# EAGLE design MovuinoHealthBandV0.2.4-EC (EAGLE 9.5.2)
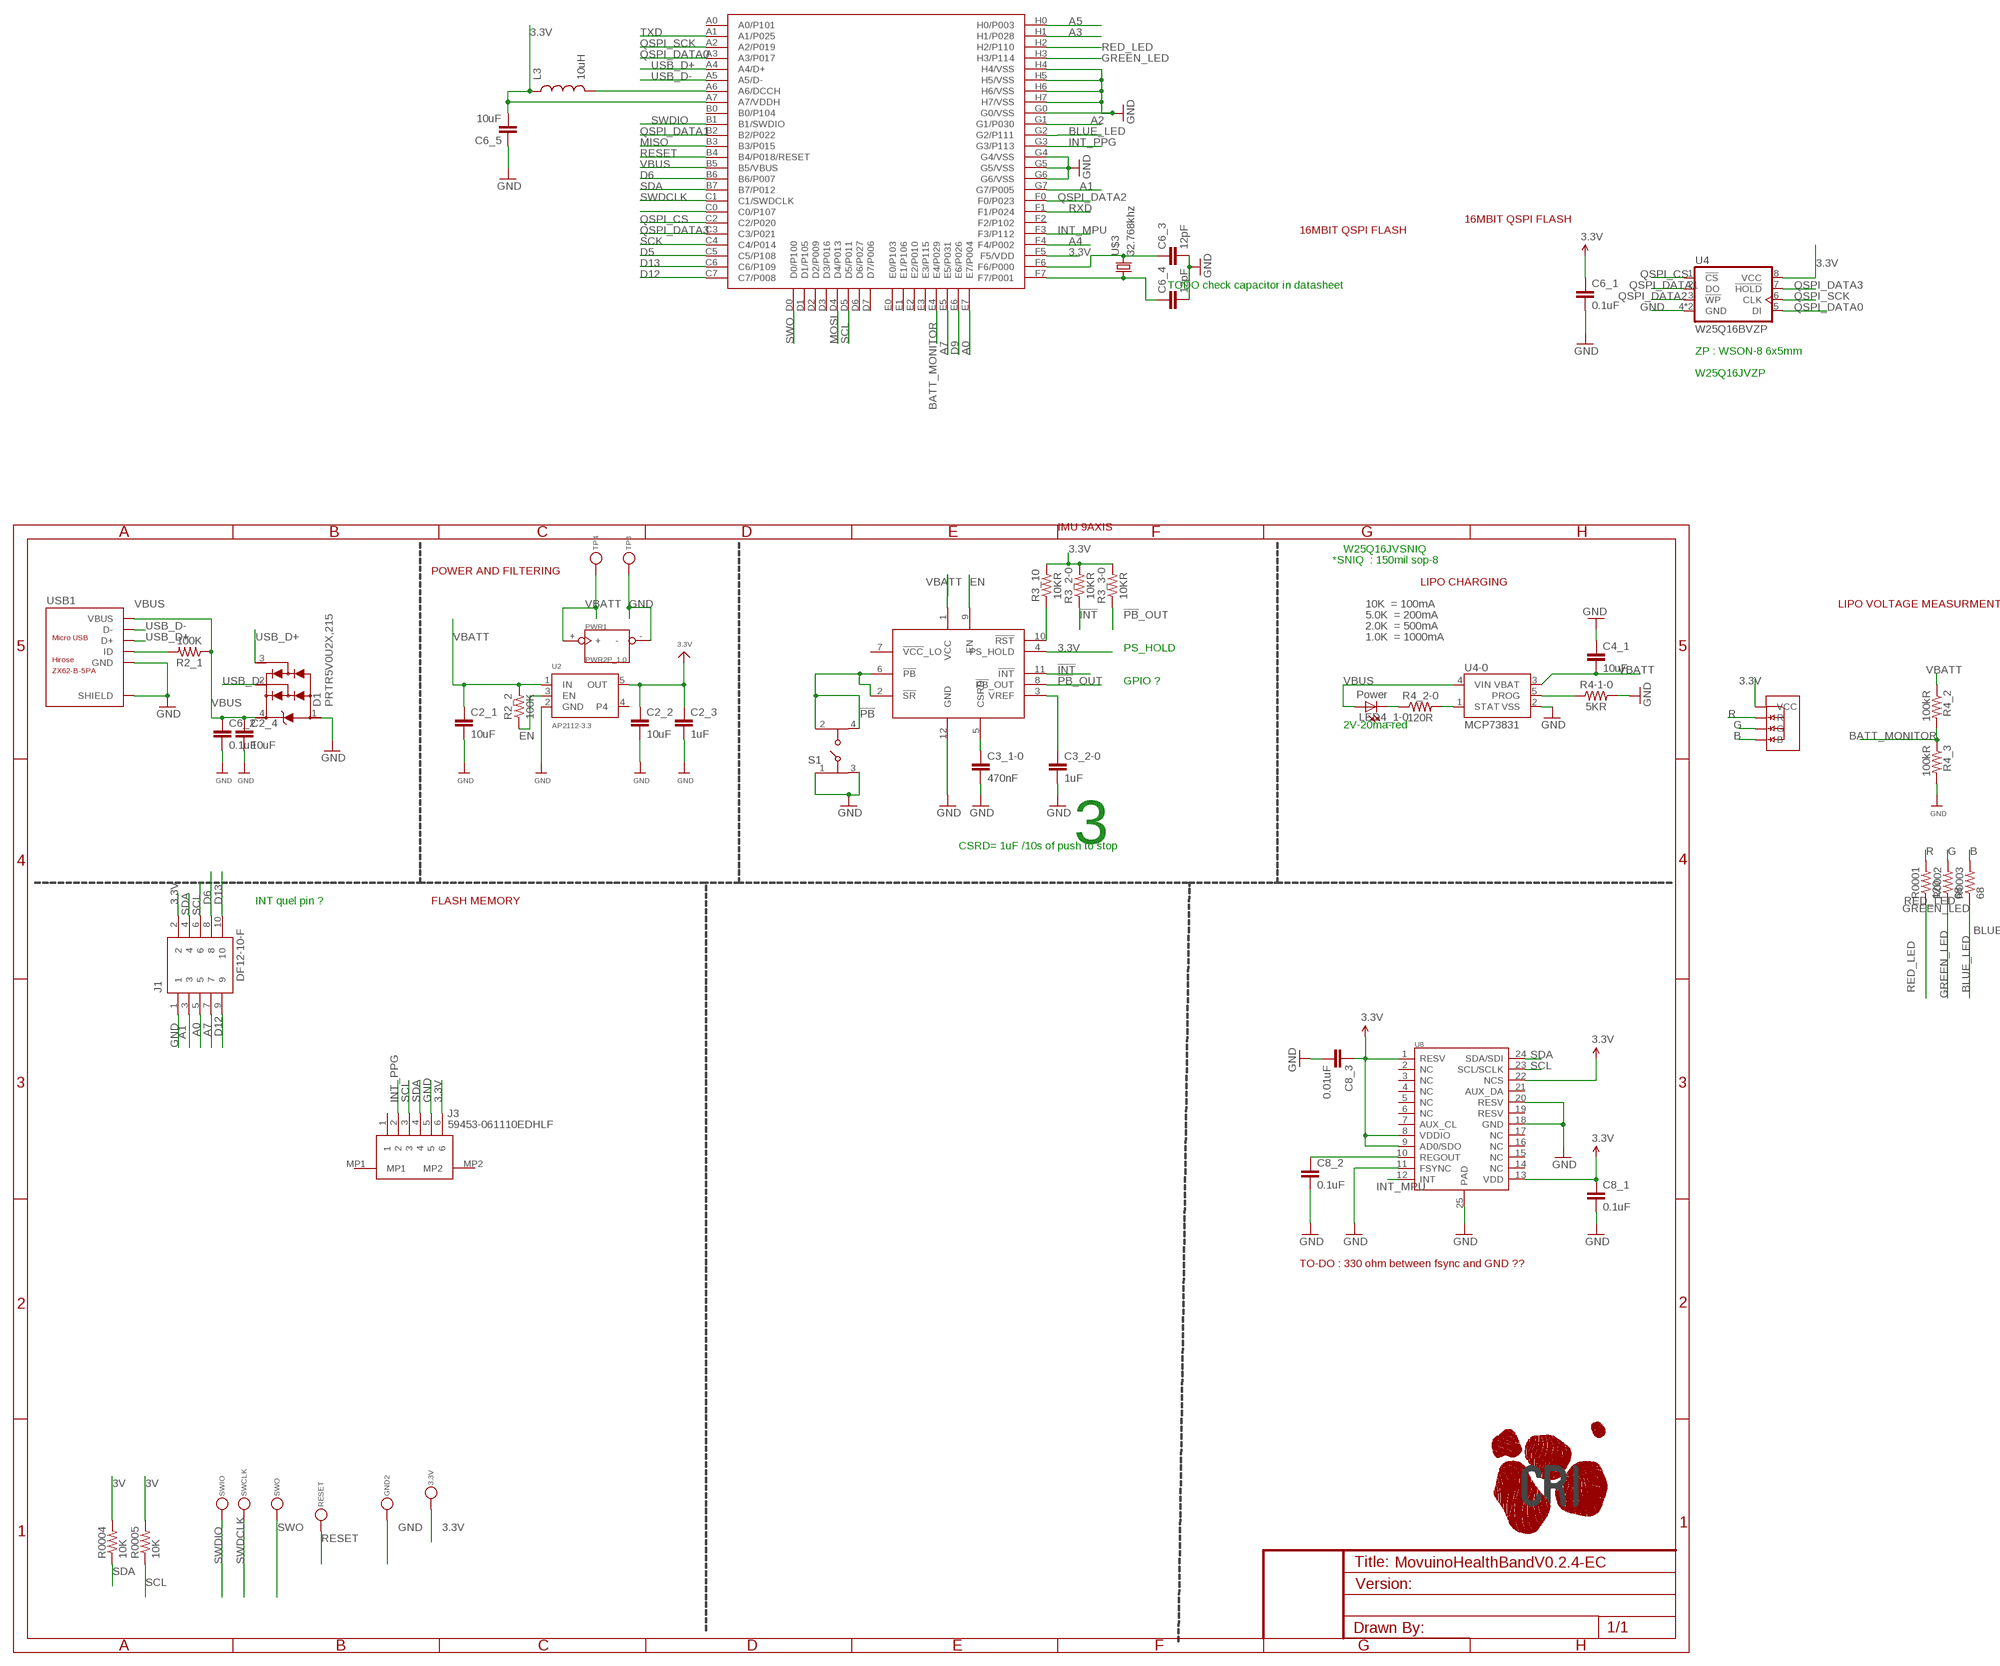
[diagram p0: schematic, sheet 1, part 1 of 2]
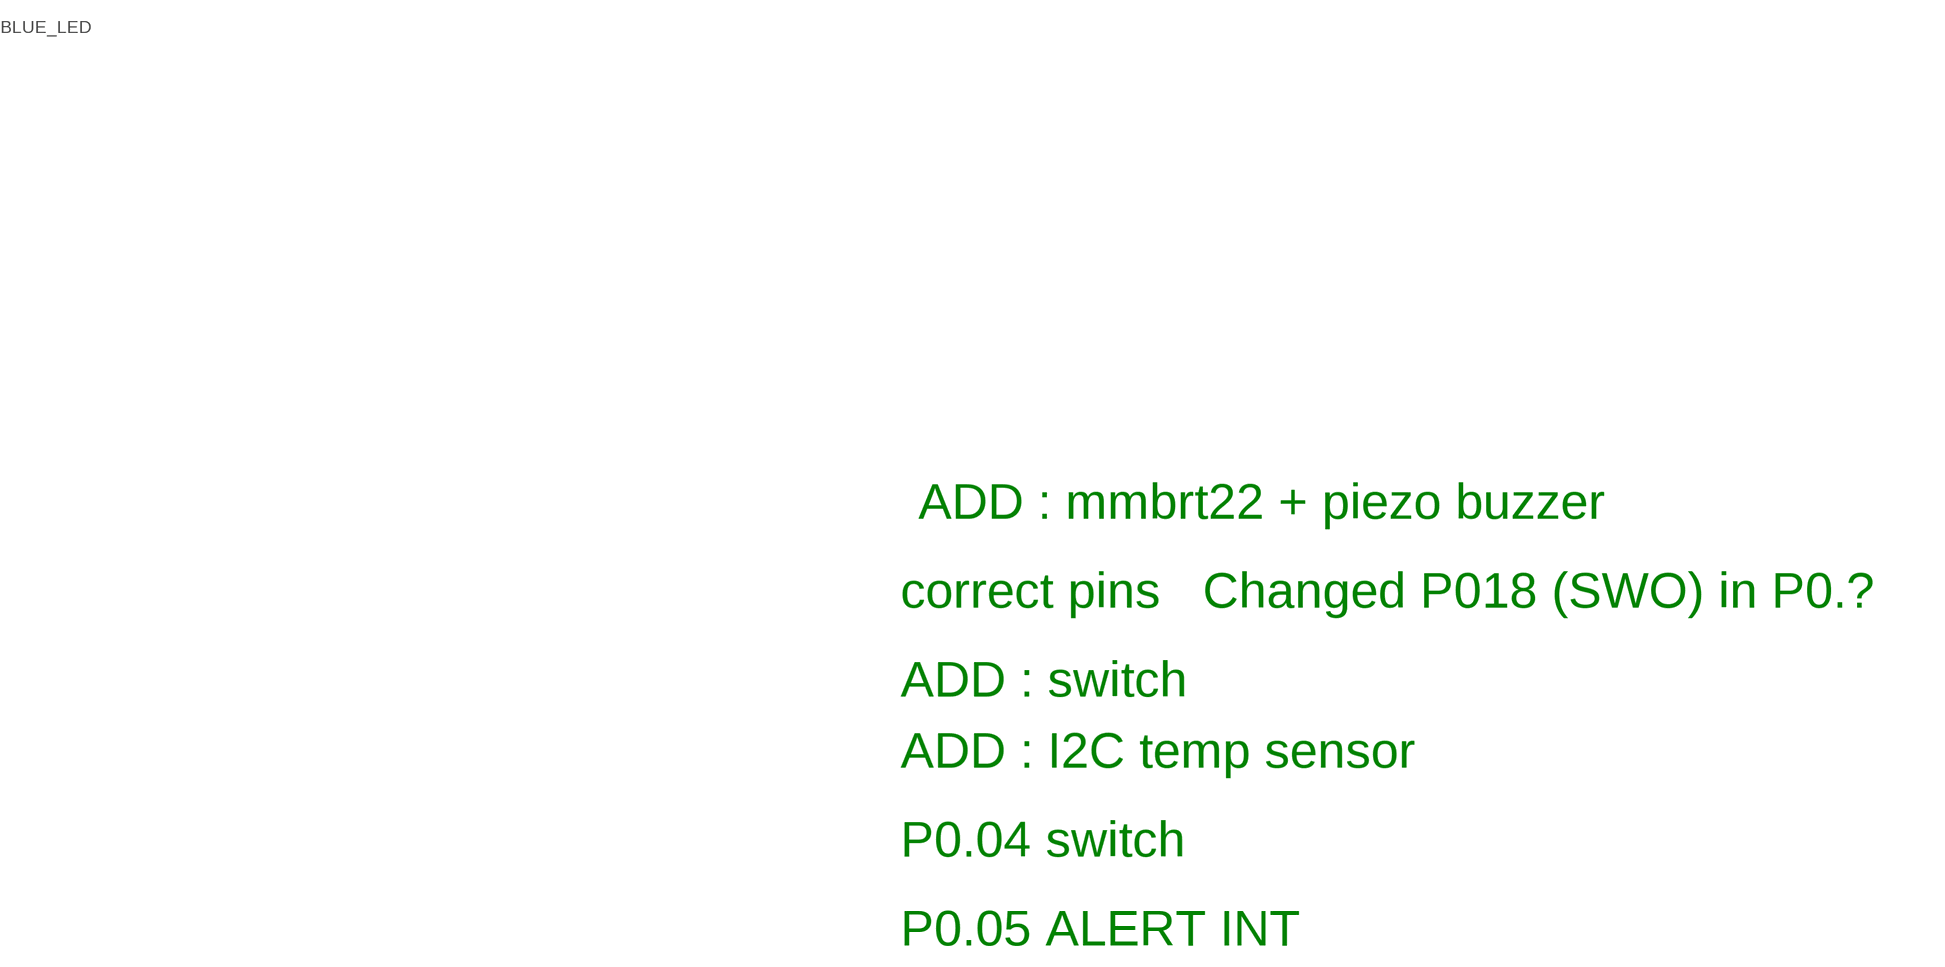
[diagram p1: schematic, sheet 1, part 2 of 2]

## Parts
3.3V  TESTPOINTROUND1MM  [TESTPOINT_ROUND_1MM]
C2_1  10uF  CAP0402-CAP-SMALL-TDOCU  [0402-CAP-SMALL-TDOCU]
C2_2  10uF  CAP0402-CAP-SMALL-TDOCU  [0402-CAP-SMALL-TDOCU]
C2_3  1uF  CAP0402-CAP-SMALL-TDOCU  [0402-CAP-SMALL-TDOCU]
C2_4  10uF  CAP0402-CAP-SMALL-TDOCU  [0402-CAP-SMALL-TDOCU]
C3_1-0  470nF  CAP0402-1UF  [0402-CAP]
C3_2-0  1uF  CAP0402-1UF  [0402-CAP]
C4_1  10uF  CAP0402-CAP-SMALL-TDOCU  [0402-CAP-SMALL-TDOCU]
C6_1  0.1uF  CAP0402-CAP-SMALL-TDOCU  [0402-CAP-SMALL-TDOCU]
C6_2  0.1uF  CAP0402-CAP-SMALL-TDOCU  [0402-CAP-SMALL-TDOCU]
C6_3  12pF  CAP0402-CAP-SMALL-TDOCU  [0402-CAP-SMALL-TDOCU]
C6_4  12pF  CAP0402-CAP-SMALL-TDOCU  [0402-CAP-SMALL-TDOCU]
C6_5  10uF  CAP0402-CAP-SMALL-TDOCU  [0402-CAP-SMALL-TDOCU]
C8_1  0.1uF  CAP0402-CAP-SMALL-TDOCU  [0402-CAP-SMALL-TDOCU]
C8_2  0.1uF  CAP0402-CAP-SMALL-TDOCU  [0402-CAP-SMALL-TDOCU]
C8_3  0.01uF  CAP0402-CAP-SMALL-TDOCU  [0402-CAP-SMALL-TDOCU]
D1  PRTR5V0U2X,215  [SOT143B]
GND2  TESTPOINTROUND1MM  [TESTPOINT_ROUND_1MM]
J1  DF12-10-F  [DF12-10-DP]
J3  59453-061110EDHLF  [59453061110EDHLF]
L3  10uH  INDUCTOR0402  [C0402]
LED4_1-0  Power  LED0603-RED-STD  [LED-0603]
PWR1  PWR2P_1.0  [PWR2P_1.0]
R0001  120  RESISTOR0402-10K  [0402-RES]
R0002  68  RESISTOR0402-10K  [0402-RES]
R2_1  100K  RESISTORR0402-SMALL-TDOCU  [R0402-SMALL-TDOCU]
R2_2  100K  RESISTORR0402-SMALL-TDOCU  [R0402-SMALL-TDOCU]
R0003  68  RESISTOR0402-10K  [0402-RES]
R3_2-0  10KR  RESISTORR0402-SMALL-TDOCU  [R0402-SMALL-TDOCU]
R3_3-0  10KR  RESISTORR0402-SMALL-TDOCU  [R0402-SMALL-TDOCU]
R3_10  10KR  RESISTORR0402-SMALL-TDOCU  [R0402-SMALL-TDOCU]
R0004  10K  RESISTOR0402-10K  [0402-RES]
R4-1-0  5KR  RESISTORR0402-SMALL-TDOCU  [R0402-SMALL-TDOCU]
R4_2  100kR  RESISTOR0402-10K  [0402-RES]
R4_2-0  120R  RESISTORR0402-SMALL-TDOCU  [R0402-SMALL-TDOCU]
R4_3  100kR  RESISTOR0402-10K  [0402-RES]
R0005  10K  RESISTOR0402-10K  [0402-RES]
RESET  TESTPOINTROUND1MM  [TESTPOINT_ROUND_1MM]
S1  434331045822  [434331045822]
SWCLK  TESTPOINTROUND1MM  [TESTPOINT_ROUND_1MM]
SWIO  TESTPOINTROUND1MM  [TESTPOINT_ROUND_1MM]
SWO  TESTPOINTROUND1MM  [TESTPOINT_ROUND_1MM]
TP3  TESTPOINT1X1.5MM_NOCREAM_NOSILK  [PAD-1X1.5_NOSILK]
TP4  TESTPOINT1X1.5MM_NOCREAM_NOSILK  [PAD-1X1.5_NOSILK]
U2  AP2112-3.3  VREG_SOT23-5  [SOT23-5]
U3  BC840  [BC840]
U3-0  STM6601  [TDFN12]
U4  W25Q16BVZP  [WSON8]
U4-0  MCP73831  [SOT23-5]
U8  MPU-9250  [LEAD-QFN24]
U$2  LOGO-CRI-NEW-110MM-BOTTOM-SILK  [LOGO_CRI-NEW-BMP10MM-BOTTOM]
U$3  32.768khz  CRYSTAL-NOGND  [CRYSTAL-SMD-2X1.2-ABS06]
U$24  LRTB_R48G  [LRTB_R48G]
USB1  MICRO-USB-SMD(ZX62-B-5PA)TB1  [MICRO-USB5+6P-SMD-0.65-AB-TB]

## Nets
3.3V [EC-Class7-drill0.15]: 3.3V.P$1 C2_2.1 C2_3.1 C6_1.1 C6_5.2 C8_1.1 C8_3.1 J1.2 J3.6 L3.1 R3_2-0.2 R3_3-0.2 R3_10.2 U2.5(OUT) U3-0.4(PS_HOLD) U3.A7(A7/VDDH) U3.F5(F5/VDD) U4.8(VCC) U8.1(RESV) U8.8(VDDIO) U8.9(AD0/SDO) U8.13(VDD) U8.22(NCS) U$24.1(VCC)
3V [EC-Class7-drill0.15]: R0004.2 R0005.2
!INT! [EC-Class7-drill0.15]: R3_2-0.1 U3-0.11(!INT!)
!PB! [EC-Class7-drill0.15]: S1.2 S1.4 U3-0.2(!SR!) U3-0.6(!PB!)
!PB!_OUT [EC-Class7-drill0.15]: R3_3-0.1 U3-0.8(!PB!_OUT)
A0 [EC-Class7-drill0.15]: J1.5 U3.E7(E7/P004)
A1 [EC-Class7-drill0.15]: J1.3 U3.G7(G7/P005)
A2 [EC-Class7-drill0.15]: U3.G1(G1/P030)
A3 [EC-Class7-drill0.15]: U3.H1(H1/P028)
A4 [EC-Class7-drill0.15]: U3.F4(F4/P002)
A5 [EC-Class7-drill0.15]: U3.H0(H0/P003)
A7 [EC-Class7-drill0.15]: J1.7 U3.E5(E5/P031)
B [EC-Class7-drill0.15]: R0003.2 U$24.4(B)
BATT_MONITOR [EC-Class7-drill0.15]: R4_2.2 R4_3.1 U3.E4(E4/P029)
BLUE_LED [EC-Class7-drill0.15]: R0003.1 U3.G2(G2/P111)
CSRD [EC-Class7-drill0.15]: C3_1-0.1 U3-0.5(CSRD)
D5 [EC-Class7-drill0.15]: U3.C5(C5/P108)
D6 [EC-Class7-drill0.15]: J1.8 U3.B6(B6/P007)
D9 [EC-Class7-drill0.15]: U3.E6(E6/P026)
D12 [EC-Class7-drill0.15]: J1.9 U3.C7(C7/P008)
D13 [EC-Class7-drill0.15]: J1.10 U3.C6(C6/P109)
EN [EC-Class7-drill0.15]: R2_2.1 U2.3(EN) U3-0.9(EN)
G [EC-Class7-drill0.15]: R0002.2 U$24.3(G)
GND [EC-Class7-drill0.15]: C2_1.2 C2_2.2 C2_3.2 C2_4.2 C3_1-0.2 C3_2-0.2 C4_1.1 C6_1.2 C6_2.2 C6_3.2 C6_4.2 C6_5.1 C8_1.2 C8_2.2 C8_3.2 D1.1 GND2.P$1 J1.1 J3.5 PWR1.- R4-1-0.2 R4_3.2 S1.1 S1.3 TP3.P$1 U2.2(GND) U3-0.12(GND) U3.G0(G0/VSS) U3.G4(G4/VSS) U3.G5(G5/VSS) U3.G6(G6/VSS) U3.H4(H4/VSS) U3.H5(H5/VSS) U3.H6(H6/VSS) U3.H7(H7/VSS) U4-0.2(VSS) U4.4(GND) U4.9(GND) U8.11(FSYNC) U8.18(GND) U8.20(RESV) U8.25(PAD) USB1.5(GND) USB1.P1(SHIELD) USB1.P2(SHIELD) USB1.P5(SHIELD) USB1.P6(SHIELD) USB1.P$3(SHIELD) USB1.P$4(SHIELD)
GREEN_LED [EC-Class7-drill0.15]: R0002.1 U3.H3(H3/P114)
INT_MPU [EC-Class7-drill0.15]: U3.F3(F3/P112) U8.12(INT)
INT_PPG [EC-Class7-drill0.15]: J3.2 U3.G3(G3/P113)
MISO [EC-Class7-drill0.15]: U3.B3(B3/P015)
MOSI [EC-Class7-drill0.15]: U3.D4(D4/P013)
N$2 [EC-Class7-drill0.15]: R4_2-0.2 U4-0.1(STAT)
N$3 [EC-Class7-drill0.15]: R2_1.2 USB1.4(ID)
N$4 [EC-Class7-drill0.15]: C6_3.1 U3.F6(F6/P000) U$3.P$2
N$6 [EC-Class7-drill0.15]: C6_4.1 U3.F7(F7/P001) U$3.P$1
N$7 [EC-Class7-drill0.15]: R3_10.1 U3-0.10(!RST!)
N$8 [EC-Class7-drill0.15]: LED4_1-0.C R4_2-0.1
N$10 [EC-Class7-drill0.15]: R4-1-0.1 U4-0.5(PROG)
N$17 [EC-Class7-drill0.15]: L3.2 U3.A6(A6/DCCH)
N$23 [EC-Class7-drill0.15]: U3.C0(C0/P107)
N$28 [EC-Class7-drill0.15]: C8_2.1 U8.10(REGOUT)
QSPI_CS [EC-Class7-drill0.15]: U3.C2(C2/P020) U4.1(!CS!)
QSPI_DATA0 [EC-Class7-drill0.15]: U3.A3(A3/P017) U4.5(DI)
QSPI_DATA1 [EC-Class7-drill0.15]: U3.B2(B2/P022) U4.2(DO)
QSPI_DATA2 [EC-Class7-drill0.15]: U3.F0(F0/P023) U4.3(!WP!)
QSPI_DATA3 [EC-Class7-drill0.15]: U3.C3(C3/P021) U4.7(!HOLD!)
QSPI_SCK [EC-Class7-drill0.15]: U3.A2(A2/P019) U4.6(CLK)
R [EC-Class7-drill0.15]: R0001.2 U$24.2(R)
RED_LED [EC-Class7-drill0.15]: R0001.1 U3.H2(H2/P110)
RESET [EC-Class7-drill0.15]: RESET.P$1 U3.B4(B4/P018/RESET)
RXD [EC-Class7-drill0.15]: U3.F1(F1/P024)
SCK [EC-Class7-drill0.15]: U3.C4(C4/P014)
SCL [EC-Class7-drill0.15]: J1.6 J3.3 R0005.1 U3.D5(D5/P011) U8.23(SCL/SCLK)
SDA [EC-Class7-drill0.15]: J1.4 J3.4 R0004.1 U3.B7(B7/P012) U8.24(SDA/SDI)
SWDCLK [EC-Class7-drill0.15]: SWCLK.P$1 U3.C1(C1/SWDCLK)
SWDIO [EC-Class7-drill0.15]: SWIO.P$1 U3.B1(B1/SWDIO)
SWO [EC-Class7-drill0.15]: SWO.P$1 U3.D0(D0/P100)
TXD [EC-Class7-drill0.15]: U3.A1(A1/P025)
USB_D+ [EC-Class7-drill0.15]: D1.3 U3.A4(A4/D+) USB1.3(D+)
USB_D- [EC-Class7-drill0.15]: D1.2 U3.A5(A5/D-) USB1.2(D-)
VBATT [EC-Class7-drill0.15]: C2_1.1 C4_1.2 PWR1.+ R2_2.2 R4_2.1 TP4.P$1 U2.1(IN) U3-0.1(VCC) U4-0.3(VBAT)
VBUS [EC-Class7-drill0.15]: C2_4.1 C6_2.1 D1.4 LED4_1-0.A R2_1.1 U3.B5(B5/VBUS) U4-0.4(VIN) USB1.1(VBUS)
VREF [EC-Class7-drill0.15]: C3_2-0.1 U3-0.3(VREF)
Unconnected: J3.1 J3.MP1 J3.MP2 U2.4 U3-0.7(!VCC!_LO) U3.A0(A0/P101) U3.B0(B0/P104) U3.D1(D1/P105) U3.D2(D2/P009) U3.D3(D3/P016) U3.D6(D6/P027) U3.D7(D7/P006) U3.E0(E0/P103) U3.E1(E1/P106) U3.E2(E2/P010) U3.E3(E3/P115) U3.F2(F2/P102) U8.2(NC) U8.3(NC) U8.4(NC) U8.5(NC) U8.6(NC) U8.7(AUX_CL) U8.14(NC) U8.15(NC) U8.16(NC) U8.17(NC) U8.19(RESV) U8.21(AUX_DA)

## Notes on the sheet
- 16MBIT QSPI FLASH
- 16MBIT QSPI FLASH
- TODO check capacitor in datasheet
- ZP : WSON-8 6x5mm
- W25Q16JVZP
- IMU 9AXIS
- W25Q16JVSNIQ
- *SNIQ  : 150mil sop-8
- POWER AND FILTERING
- LIPO CHARGING
- 10K  = 100mA | LIPO VOLTAGE MEASURMENT
- 5.0K  = 200mA
- 2.0K  = 500mA
- 1.0K  = 1000mA
- PS_HOLD
- GPIO ?
- 2V-20ma-red
- 3
- CSRD= 1uF /10s of push to stop
- INT quel pin ? | FLASH MEMORY
- ADD : mmbrt22 + piezo buzzer
- TO-DO : 330 ohm between fsync and GND ??
- correct pins | Changed P018 (SWO) in P0.?
- ADD : switch
- ADD : I2C temp sensor
- P0.04 switch
- P0.05 ALERT INT

## Library data of the parts
3.3V GND2 RESET SWCLK SWIO SWO TP3 TP4 = movuino:TESTPOINT: Test Point Various test points for characterisation and PCB testing TESTPOINT_SMT - Compact Surface Mount Test Point [Digikey: 5016KTR-ND]
C2_1-C2_4 C4_1 C6_1-C6_5 C8_1-C8_3 = movuinoV0:CAP: Capacitor Standard 0402 ceramic capacitor 0.1uF , 100nF
C3_1-0 = movuino:CAP: Capacitor Standard 0402 ceramic capacitor 0.1uF , 100nF; DIELECTRIC: MLCC, X5R; MF: Murata Electronics; MPN: GRM155R61A105KE15D; OC_MOUSER: 81-GRM155R61A105KE15; OC_RS: 7235199; TOLERANCE: 10%; VALUE: 1uF; VOLTAGE: 10V
C3_2-0 = movuino:CAP: Capacitor Standard 0402 ceramic capacitor 0.1uF , 100nF; DIELECTRIC: MLCC, X5R; MF: Murata Electronics; MPN: GRM155R61A105KE15D; OC_MOUSER: 81-GRM155R61A105KE15; OC_RS: 7235199; TOLERANCE: 10%; VOLTAGE: 10V
D1 = movuino:PRTR5V0U2X,215: Ultra low capacitance double rail-to-rail ESD protection diode; AVAILABILITY: Unavailable; DESCRIPTION: PRTR5V0U2X Series 9 V 16 pF Rail-to-Rail ESD Protection Diode - SOT-143B; MF: Nexperia USA; MP: PRTR5V0U2X,215; PACKAGE: SOT-143 NXP Semiconductors; PRICE: None
J1 = movuino:DF12-10-F: CONN HEADER 20POS 3MM SMD 0.5MM; MF: Hirose; MPN: DF12E(3.0)-10DP-0.5V(81); OC_MOUSER: 798-DF12E3010DP05V81
J3 = movuino:59453-061110EDHLF: 4w FFC SMT header bottom contact 0.5mm Source: Datasheet <http://portal.fciconnect.com/Comergent//fci/drawing/59453-0_1110edhlf.pdf>
L3 = SparkFun-Passives:INDUCTOR: Inductors Basic Inductor/Choke - 0603 and 1206. Footprints are not proven and vary greatly between part numbers.
LED4_1-0 = movuino:LED: LEDs Standard schematic elements and footprints for 5mm, 3mm, 1206, and 0603 sized LEDs. 5mm - Spark Fun Electronics SKU : COM-00529 (and others); COLOUR: Red; FORWARD_INTENSITY: 25ma; FORWARD_VOLTAGE: 2.5V; LUMINOUS_INTENSITY: 180mcd; MF: OSRAM Opto Semiconductors; MPN: LS Q976-NR-1; OC_MOUSER: 720-LSQ976-NR-1; OC_RS: 6545420
PWR1 = movuino:PWR2P; MF: JST; MPN: SM02B-SRSS-TB(LFSN); OC_RS: 5151490
R0001-R0003 R4_2 R4_3 = movuino:RESISTOR: Resistor; MF: TE Connectivity; MPN: CRG0402F10K; OC_MOUSER: 279-CRG0402F10K; OC_RS: 6678848; POWER_RATING: 0.063W; TOLERANCE: 1%; VALUE: 10K
R2_1 R2_2 R3_2-0 R3_3-0 R3_10 R4-1-0 R4_2-0 = movuinoV0:RESISTOR: Resistor
R0004 R0005 = movuino:RESISTOR: Resistor; MF: TE Connectivity; MPN: CRG0402F10K; OC_MOUSER: 279-CRG0402F10K; OC_RS: 6678848; POWER_RATING: 0.063W; TOLERANCE: 1%
S1 = Wurth_Elektronik_Electromechanic_Switch_rev17c:434331045822: 3.5x4.7 mm SMD side push WS-TASU <http://katalog.we-online.de/media/images/v2/Family_WS_TUS_Normal_SMD_Side-Push_4343x10458xx_pf2.jpg> Details see: http://katalog.we-online.de/em/datasheet/4343x10458xx.pdf 2015 (C) Wurth Elektronik
U2 = microbuilder:VREG_SOT23-5: SOT23-5 Fixed Voltage Regulators Part Current Out V Out V In V Dropout θJA (°C/W) TJ (°C) Digikey Part No. ADP121 150mA 3.3V 3.4-5.5V 0.09V @ 150mA -- -- ADP121-AUJZ33R7CT-ND ADP121 150mA 3.0V 3.1-5.5V 0.09V @ 150mA -- -- ADP121-AUJZ30R7CT-ND ADP122 300mA 3.3V 3.4-5.5V 0.085V @ 300mA -- -- ADP122AUJZ-3.3-R7CT-ND ADP1712 300mA 3.3V 3.5-5.5V 0.17V @ 300mA -- -- ADP1712AUJZ-3.3-R7TR-ND AP7311 (Low Cost) 150mA 3.3V 3.5-6V 0.15V @ 150mA -- -- AP7311-33WG-7DICT-ND LD39015M18R 150mA 1.8V 1.9V-5.5V 0.08V @ 100mA -- -- 497-6977-1-ND LP2985A-33DBVR 150mA 3.3V 3.3-16V 0.28V @ 150mA 206 150 296-18479-1-ND MCP1824T-3302E/OT 300mA 3.3V 3.5V-6V 0.2V @ 300mA -- -- MCP1824T-3302E/OTCT-ND MIC5205-2.5YM5 TR 150mA 2.5V 2.7-16V 0.165V @ 150mA -- -- 576-1257-2-ND MIC5205-3.0YM5 TR 150mA 3.0V 3.2V-16V 0.165V @ 150mA -- -- 576-1258-2-ND MIC5205-3.3YM5 TR 150mA 3.3V 3.5V-16V 0.165V @ 150mA -- -- 576-1259-2-ND TPS780330220 150mA 3.3V+2.2V 3.6-5.5V 250mV Max -- -- 296-23332-1-ND TDA3663/N1,135 100mA 3.3V 3.5-45V 0.18V @ 50mA -- -- 568-5343-1-ND Max operating temp can be calculated using θJA, TJ (max junction temperature), and power in watts. Set the "Maximum Ambient Temperature" until it reaches TJ ("Max Junction Temperature"), which is the absolute limit for safe use of the regulator: Heat Sink Temperature Calculator <http://www.daycounter.com/Calculators/Heat-Sink-Temperature-Calculator.phtml> For example, With 12V source into a 3.3V LP2985 and a 30mA load, we are dissipating (12V-3.3V) * 0.03A = 0.261W. With a θJA of 206 °C/W, a TJ of 150°C, and 261mW we can safely use the chip without a heat sink up to 75°C (=147.1°C Junction Temperature).
U3 = BC840-v1-aligned:BC840
U3-0 = movuino:STM6601
U4 = movuino:W25Q16BV: EEPROM 4 Mbit SPI Serial Flash7
U4-0 = movuino:MCP73831: Miniature single cell, fully integrated Li-Ion, Li-polymer charge management controller http://ww1.microchip.com/downloads/en/DeviceDoc/21984a.pdf IC-09995; MF: Microchip; MPN: MCP73831T-2ACI/OT; OC_MOUSER: 579-MCP73831T-2ACIOT; OC_RS: 7386360
U8 = movuino:MPU-9250; MF: InvenSense; MPN: MPU-9250; OC_RS: 8837942
U$2 = movuino_aestheticsV0:LOGO-CRI-NEW-1
U$3 = movuino:CRYSTAL-NOGND
U$24 = movuino:LRTB_R48G; MF: Osram Opto Semiconductors; MPN: LRTBR48G; OC_MOUSER: 720-LRTBR48G; OC_RS: 8769299
USB1 = movuino:MICRO-USB-SMD(ZX62-B-5PA): 320010005

## Net classes
1 power: width 0.254 mm
2 pcbway_cheap: width 0.152 mm, drill 0.3 mm, clearance 0.152 mm
3 pcbway_5mil: width 0.127 mm, drill 0.25 mm, clearance 0.127 mm
4 pcbway_4mil: width 0.102 mm, drill 0.2 mm, clearance 0.102 mm
5 EC-Class7-drill0.15: width 0.125 mm, drill 0.15 mm, clearance 0.125 mm

## Board
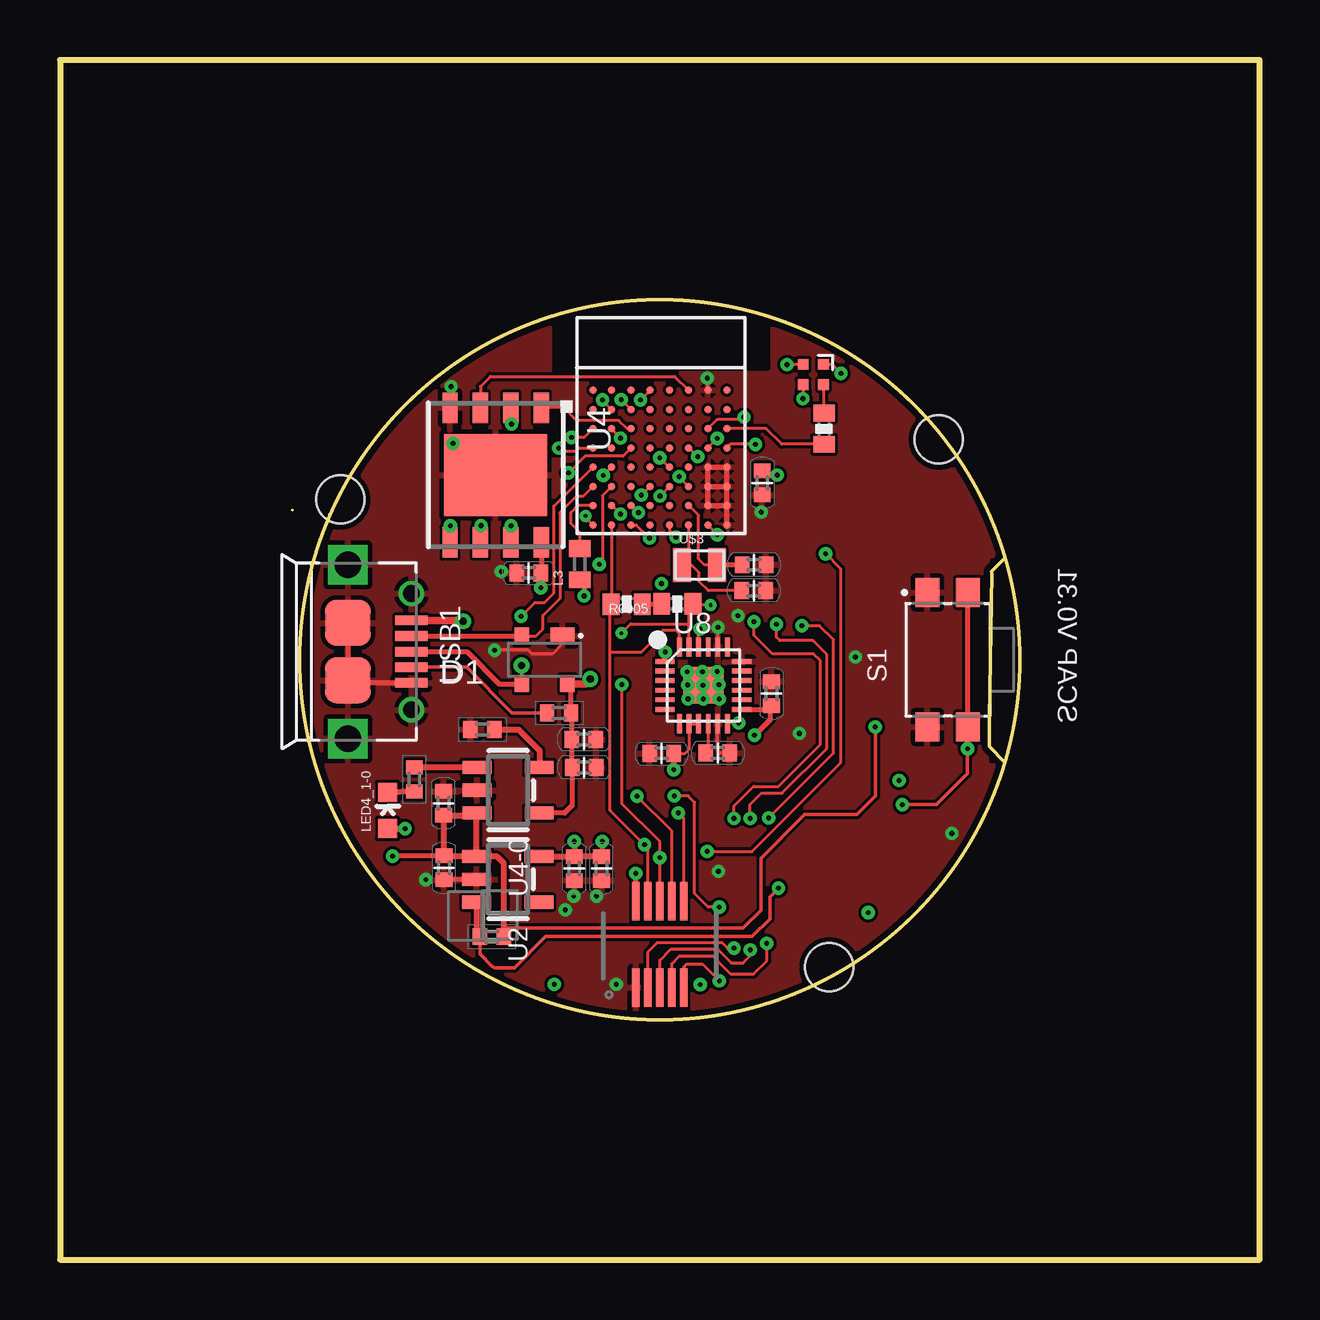
[diagram p2: board, top side]
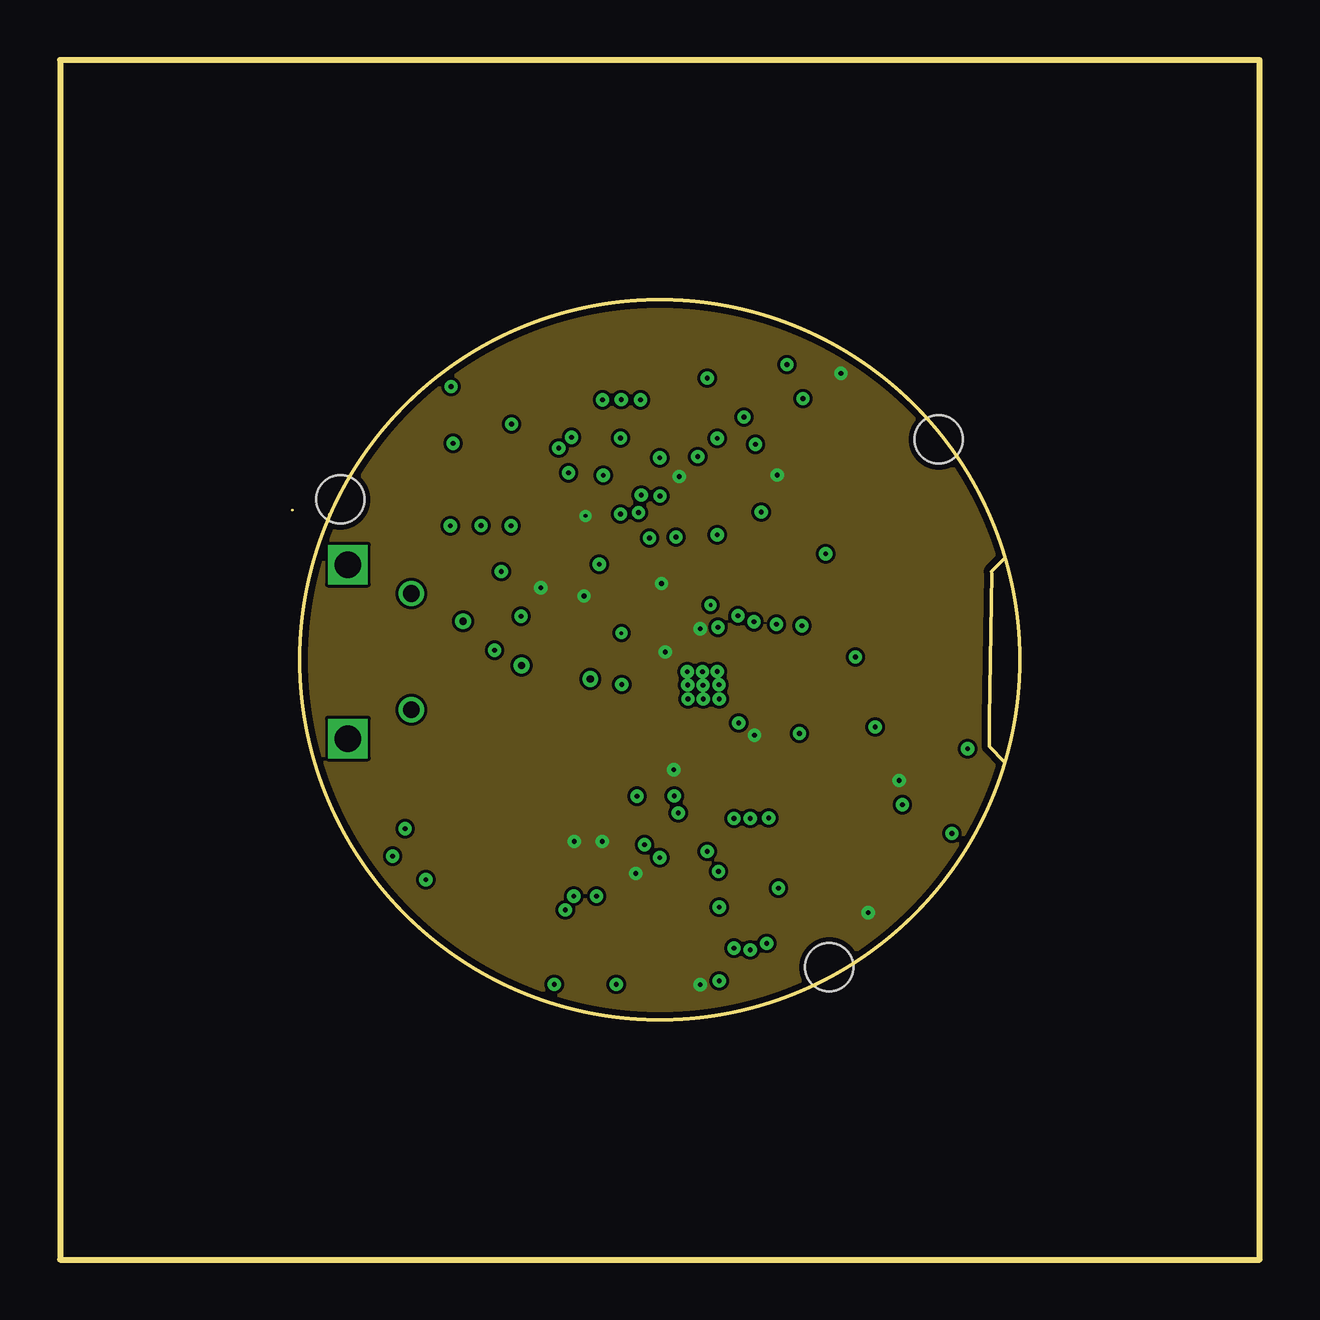
[diagram p3: board, inner layer VCC]
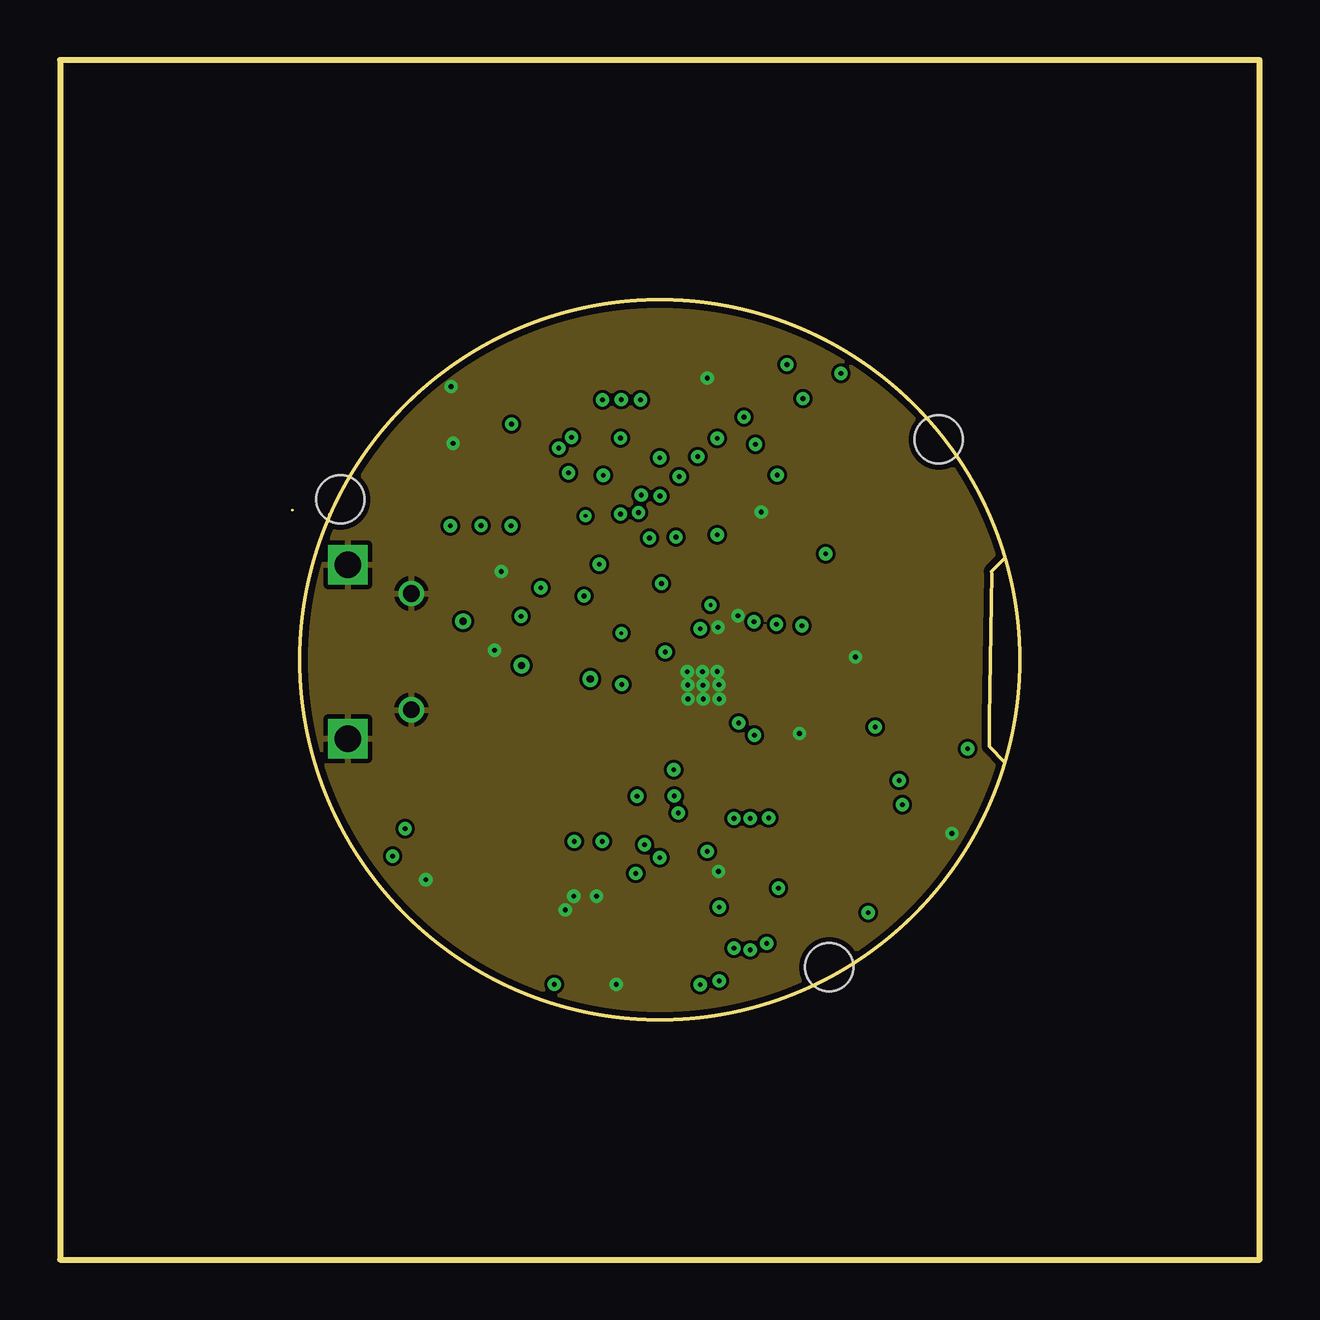
[diagram p4: board, inner layer GND2-EC]
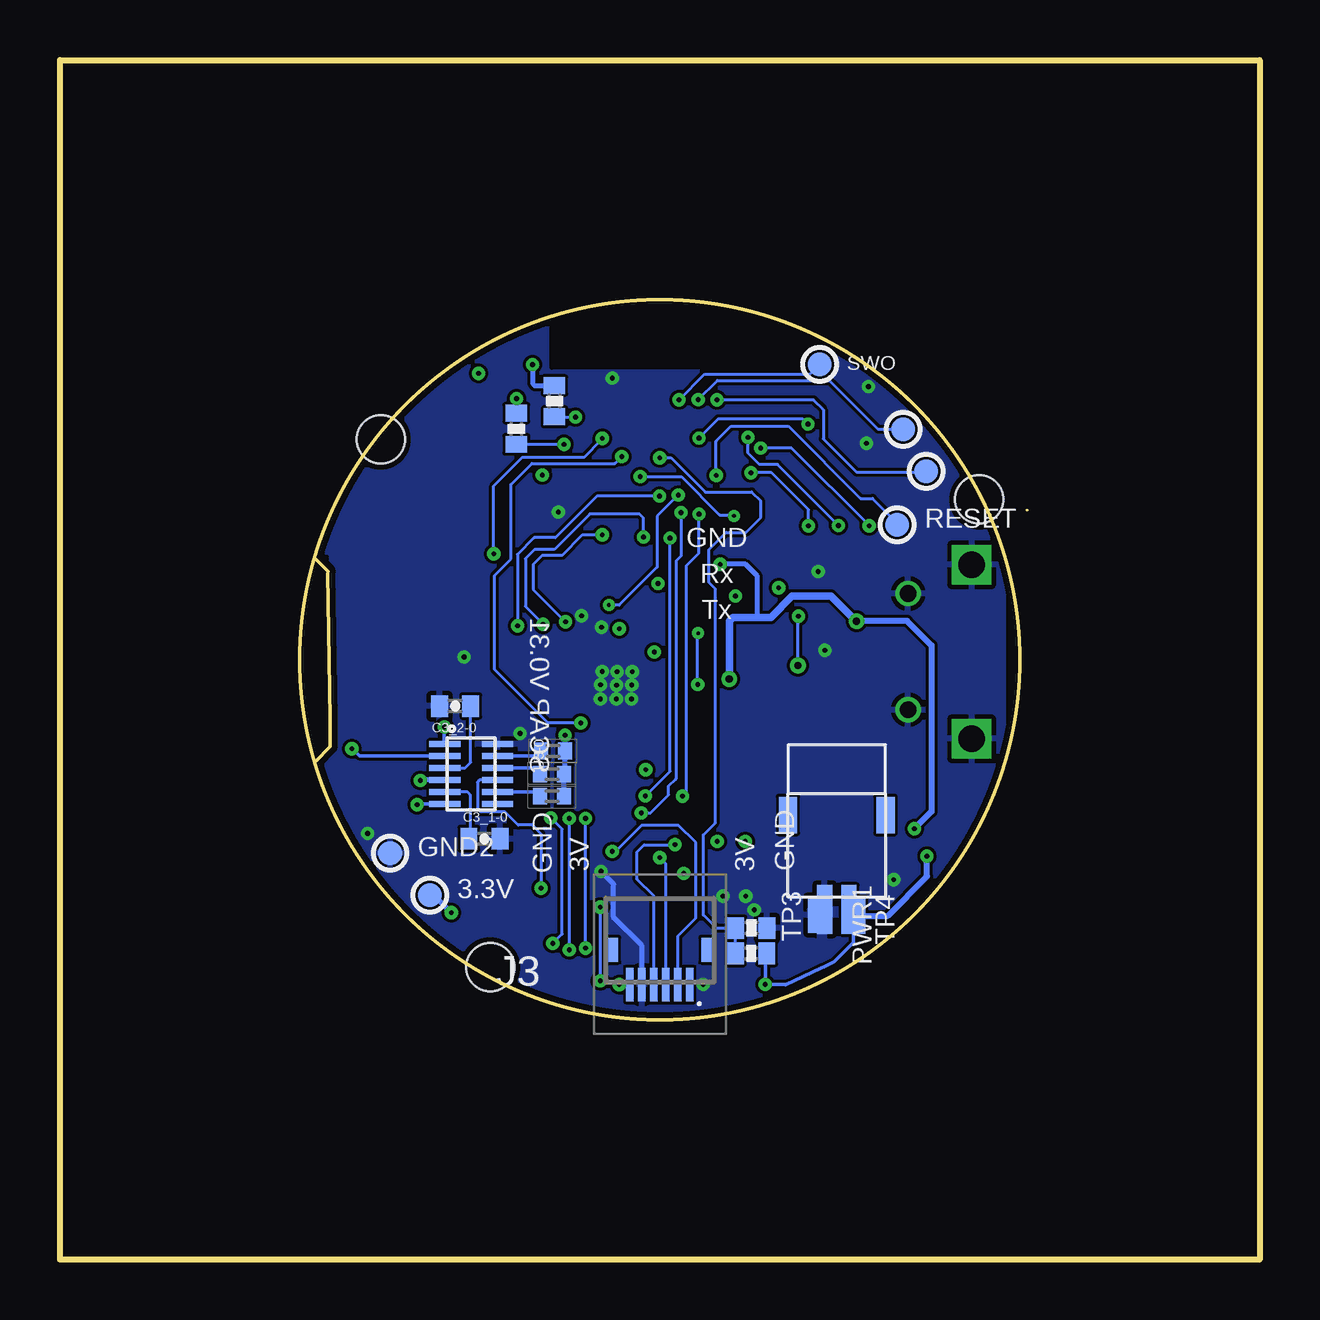
[diagram p5: board, bottom side, seen from below]

Size 50 x 50 mm. Coordinates in mm from the lower left corner, seen from the top.
Outline: 11.25,31.03 11.22,31.06
Outline: 11.25,18.98 11.27,18.96
Outline: 9.68,31.24 9.69,31.25
Outline: 11.33,31.25 11.36,31.28
Outline: 38.74,22.55 38.84,28.6
Outline: 38.73,22.61 38.73,21.38 39.36,20.75
Outline: 38.82,28.67 39.39,29.24 39.39,29.25
Outline: 0,0 50,0 50,50 0,50 0,0
Outline: circle at 25,25 radius 15
Copper layers (1+2*3+16): Top 0.018mm / dielectric 0.36mm / VCC 0.035mm / dielectric 0.71mm / GND2-EC 0.035mm / dielectric 0.36mm / Bottom 0.018mm
Design rules "eC_4Layer_PClass7_BaseCopperO18-I35 *": minimum track width 0.125mm, minimum drill 0.15mm, track to track 0.125mm, track to pad 0.125mm, pad to pad 0.125mm, via to via 0.125mm, smd to smd 0mil, copper to edge 0.25mm, drill to drill 0.35mm, minimum pad ring 0.175mm, minimum via ring 0.175mm, stop-mask expansion 0mil, vias tented up to drill 0.45mm, thermal gap 0.2mm
Holes 2 mm at 36.63,34.18 32.07,12.18 11.68,31.68
tRestrict: area 20.6,37.2 to 29.5,40.8; area 8.8,21.7 to 10.5,29; area 38.8,21.8 to 40.6,29.2; area 38.8,20.8 to 40.5,28.1
bRestrict: area 20.6,37.2 to 29.5,40.8; area 8.8,21.7 to 10.5,29; area 38.9,20.9 to 40.6,29.3

### Footprints (pad centres in the part's own frame; a part is rotated, then mirrored left to right if it is on the bottom)
TESTPOINT_ROUND_1MM = smd 1 x 1: P$1 0,0
0402-CAP-SMALL-TDOCU = smd 0.6 x 0.7: 1 -0.5,0; 2 0.5,0
0402-CAP = smd 0.7 x 0.9: 1 -0.65,0; 2 0.65,0
SOT143B = smd 1 x 0.7: 1 -0.75,-1 | smd 0.6 x 0.7: 2 0.95,-1; 3 0.95,1; 4 -0.95,1
DF12-10-DP = smd 0.3 x 1.6: 1 -1,-1.8; 2 -1,1.8; 3 -0.5,-1.8; 4 -0.5,1.8; 5 0,-1.8; 6 0,1.8; 7 0.5,-1.8; 8 0.5,1.8; 9 1,-1.8; 10 1,1.8
59453061110EDHLF = smd 0.3 x 1.4: 1 -1.25,0.1; 2 -0.75,0.1; 3 -0.25,0.1; 4 0.25,0.1; 5 0.75,0.1; 6 1.25,0.1 | smd 0.52 x 1: MP1 -1.99,-1.35; MP2 1.99,-1.35
C0402 = smd 0.7 x 0.9: 1 -0.65,0; 2 0.65,0
LED-0603 = smd 0.8 x 0.8: A 0,-0.75; C 0,0.75
PWR2P_1.0 = smd 2.032 x 0.635: + 0.508,0.508; - 0.508,-0.508 | smd 1.524 x 0.762: P$3 -3.429,2.032; P$4 -3.429,-2.032
0402-RES = smd 0.7 x 0.9: 1 -0.65,0; 2 0.65,0
R0402-SMALL-TDOCU = smd 0.6 x 0.7: 1 -0.5,0; 2 0.5,0
434331045822 = smd 1.2 x 1: 1 2.8,0.85; 2 2.8,-0.85; 3 -2.8,0.85; 4 -2.8,-0.85
PAD-1X1.5_NOSILK = smd 1 x 1.5: P$1 0,0
SOT23-5 = smd 0.55 x 1.2: 1 -0.95,-1.3; 2 0,-1.3; 3 0.95,-1.3; 4 0.95,1.3; 5 -0.95,1.3
BC840 = smd 0.305 x 0.305: A0 -2.79,2.816; A1 -2.79,2.003; A2 -2.79,1.216; A3 -2.79,0.403; A4 -2.79,-0.385; A5 -2.79,-1.197; A6 -2.79,-1.985; A7 -2.79,-2.798; B0 -2.002,2.816; B1 -2.002,2.003; B2 -2.002,1.216; B3 -2.002,0.403; B4 -2.002,-0.385; B5 -2.002,-1.197; B6 -2.002,-1.985; B7 -2.002,-2.798; C0 -1.189,2.816; C1 -1.189,2.003; C2 -1.189,1.216; C3 -1.189,0.403; C4 -1.189,-0.385; C5 -1.189,-1.197; C6 -1.189,-1.985; C7 -1.189,-2.798; D0 -0.402,2.816; D1 -0.402,2.003; D2 -0.402,1.216; D3 -0.402,0.403; D4 -0.402,-0.385; D5 -0.402,-1.197; D6 -0.402,-1.985; D7 -0.402,-2.798; E0 0.411,2.816; E1 0.411,2.003; E2 0.411,1.216; E3 0.411,0.403; E4 0.411,-0.385; E5 0.411,-1.197; E6 0.411,-1.985; E7 0.411,-2.798; F0 1.198,2.816; F1 1.198,2.003; F2 1.198,1.216; F3 1.198,0.403; F4 1.198,-0.385; F5 1.198,-1.197; F6 1.198,-1.985; F7 1.198,-2.798; G0 2.011,2.816; G1 2.011,2.003; G2 2.011,1.216; G3 2.011,0.403; G4 2.011,-0.385; G5 2.011,-1.197; G6 2.011,-1.985; G7 2.011,-2.798; H0 2.798,2.816; H1 2.798,2.003; H2 2.798,1.216; H3 2.798,0.403; H4 2.798,-0.385; H5 2.798,-1.197; H6 2.798,-1.985; H7 2.798,-2.798
TDFN12 = smd 0.25 x 1.3: 1 -1.25,-1.1; 2 -0.75,-1.1; 3 -0.25,-1.1; 4 0.25,-1.1; 5 0.75,-1.1; 6 1.25,-1.1; 7 1.25,1.1; 8 0.75,1.1; 9 0.25,1.1; 10 -0.25,1.1; 11 -0.75,1.1; 12 -1.25,1.1
WSON8 = smd 0.635 x 1.27: 1 -1.905,-2.81; 2 -0.635,-2.81; 3 0.635,-2.81; 4 1.905,-2.81; 5 1.905,2.81; 6 0.635,2.81; 7 -0.635,2.81; 8 -1.905,2.81 | smd 4.3 x 3.4: 9 0,0
LEAD-QFN24 = smd 0.8 x 0.2: 1 -1.6,1; 2 -1.6,0.6; 3 -1.6,0.2; 4 -1.6,-0.2; 5 -1.6,-0.6; 6 -1.6,-1; 13 1.6,-1; 14 1.6,-0.6; 15 1.6,-0.2; 16 1.6,0.2; 17 1.6,0.6; 18 1.6,1 | smd 0.2 x 0.8: 7 -1,-1.6; 8 -0.6,-1.6; 9 -0.2,-1.6; 10 0.2,-1.6; 11 0.6,-1.6; 12 1,-1.6; 19 1,1.6; 20 0.6,1.6; 21 0.2,1.6; 22 -0.2,1.6; 23 -0.6,1.6; 24 -1,1.6 | smd 1.7 x 1.54: 25 0,0; 26 0,0
CRYSTAL-SMD-2X1.2-ABS06 = smd 0.75 x 1.4: P$1 -0.725,0; P$2 0.725,0
LRTB_R48G = smd 0.45 x 0.45: 1 0.425,0.425; 2 0.425,-0.425; 3 -0.425,-0.425; 4 -0.425,0.425
MICRO-USB5+6P-SMD-0.65-AB-TB = smd 0.4 x 1.35: 1 -1.3,2.65; 2 -0.65,2.65; 3 0,2.65; 4 0.65,2.65; 5 1.3,2.65 | smd 1.9 x 1.9: P1 -1.2,0; P2 1.2,0 | drill 0.7: P5 -2.425,2.65; P6 2.425,2.65 | drill 1.1 square: P$3 -3.625,0; P$4 3.625,0

### Placement (x,y rotation side)
3.3V  34.58,15.19 0 bottom
C2_1  16.01,16.33 270 top
C2_2  22.57,16.3 270 top
C2_3  21.44,16.3 270 top
C2_4  21.85,20.51 0 top
C3_1-0  32.31,17.54 0 bottom
C3_2-0  33.53,23.07 180 bottom
C4_1  15.99,19.02 270 top
C6_1  19.54,28.62 180 top
C6_2  21.84,21.68 0 top
C6_3  28.93,28.96 0 top
C6_4  28.92,27.88 0 top
C6_5  29.27,32.37 90 top
C8_1  29.66,23.59 90 top
C8_2  27.42,21.11 0 top
C8_3  25.08,21.1 180 top
D1  20.2,25 180 top
GND2  36.24,16.94 0 bottom
J1  25,13.14 0 top
J3  25,11.56 180 bottom
L3  21.67,28.98 90 top
LED4_1-0  13.66,18.72 0 top
PWR1  17.62,15.1 270 bottom
R0001  31.85,34.63 90 top
R0002  30.98,34.63 90 bottom
R2_1  20.8,22.78 180 top
R2_2  18,13.46 0 top
R0003  29.39,35.78 90 bottom
R3_2-0  29.45,21.2 0 bottom
R3_3-0  29.49,19.31 0 bottom
R3_10  29.49,20.23 0 bottom
R0004  23.62,27.32 0 top
R4-1-0  17.61,22.09 180 top
R4_2  21.19,12.76 180 bottom
R4_2-0  14.77,20.01 90 top
R4_3  21.18,13.82 0 bottom
R0005  25.73,27.33 180 top
RESET  15.11,30.63 0 bottom
S1  37,25 90 top
SWCLK  14.86,34.61 0 bottom
SWIO  13.9,32.85 0 bottom
SWO  18.33,37.32 0 bottom
TP3  18.33,14.37 180 bottom
TP4  16.93,14.33 180 bottom
U2  18.67,15.85 270 top
U3  25,33.42 0 top
U3-0  32.86,20.23 270 bottom
U4  18.16,32.7 180 top
U4-0  18.68,19.56 270 top
U8  26.82,23.93 0 top
U$2  43.62,58.53 0 top  (outside the outline)
U$3  26.66,28.95 0 top
U$24  31.4,36.89 0 top
USB1  12,25.34 270 top

### Tracks (layer width: path | path; a pad name or v marks a point on that pad's centre or on a via)
3.3V  (via drill 0.15, 0.2, 0.2 pad 0.4, 0.2 pad 0.45)
  Top 0.125: U3.A7 21.91,30.93 v21.91,30.99 | U3.F5 25.81,32.61 v25.81,32.63 | U8.9 U8.8 26.22,21.27 26.05,21.1 C8_3.1 | U$24.1 32.17,37.31 v32.55,36.94 | U8.22 26.62,26.22 v26.69,26.29
  Top 0.2: U4.8 20.07,28.64 C6_1.1 v20.04,28 | U8.13 29.5,22.93 29.62,23.05 | 29.62,23.05 C8_1.1 | U8.1 v25.22,25.31 v25.23,25.32 | v22.6,17.43 22.6,16.83 C2_2.1 | v21.44,17.43 C2_3.1 | J1.2 v24,16.09 | L3.1 21.84,28.16 v21.84,27.66 | v28.95,21.85 29.62,22.52 29.62,23.05 | C8_3.1 v25.58,20.42 | v29.9,32.7 29.44,32.7 C6_5.2
  Top 0.254: U2.5 C2_3.1 C2_2.1
  Bottom 0.125: v21.91,30.99 21.91,31.04 22.51,31.04 24.1,32.63 v25.81,32.63 | v26.69,11.46 J3.6
  Bottom 0.2: 3.3V.P$1 34.42,15.19 v33.69,14.46 | R3_3-0.2 R3_10.2 28.95,20.27 R3_2-0.2 v28.95,21.85 | U3-0.4 v34.97,19.98 v34.98,19.97
  other vias: 25.07,28.18
  pour VCC: 10.2,25 arc-90 25,39.8 arc-90 39.8,25 arc-90 25,10.2 arc-90
3V
  Top 0.2: R0004.2 R0005.2
!INT!
  Bottom 0.152: U3-0.11 30.17,20.98 R3_2-0.1
!PB!  (via drill 0.2 pad 0.4)
  Top 0.15: v35.12,18.96 36.53,18.96 37.83,20.26 v37.83,21.29
  Top 0.2: v37.83,21.29 37.83,22.18 S1.4 S1.2
  Bottom 0.152: U3-0.6 35.1,18.98 v35.12,18.96 | U3-0.2 37.52,20.98 v37.83,21.29
!PB!_OUT
  Bottom 0.152: U3-0.8 30.16,19.48 R3_3-0.1
A0  (via drill 0.2 pad 0.4, 0.2 pad 0.45)
  Top 0.125: v28.77,18.39 28.77,18.97 29.24,19.44 30.1,19.44 31.96,21.3 31.96,25.22 31.38,25.8 30,25.8 29.86,25.94 v29.86,26.48 | v25.68,30.12 25.41,30.39 U3.E7 | J1.5 25,12.47 25.47,12.94 27.4,12.94 27.98,12.36 28.47,12.36 28.77,12.66 v28.77,12.91
  Bottom 0.125: v25.68,30.12 25.68,30.91 25.85,31.08 27.91,31.08 29.39,29.6 30.21,29.6 30.6,29.21 30.6,27.22 v29.86,26.48 | v28.77,12.91 v28.77,18.39
A1  (via drill 0.2 pad 0.4, 0.2 pad 0.45)
  Top 0.125: v28.09,18.38 28.09,18.9 28.91,19.72 29.95,19.72 31.69,21.46 31.69,24.96 31.41,25.24 29.7,25.24 28.93,26.01 v28.93,26.58 | J1.3 24.49,12.8 24.88,13.19 27.61,13.19 27.82,12.98 v28.09,12.98 | U3.G7 27.4,30.23 v27.4,30.21
  Bottom 0.125: v28.93,26.58 30.28,27.93 30.28,28.97 29.9,29.35 29.07,29.35 28.21,30.21 v27.4,30.21 | v28.09,12.98 v28.09,18.38
A7  (via drill 0.2 pad 0.4, 0.2 pad 0.45)
  Top 0.125: U3.E5 v25.01,31.82 | v29.54,18.41 32.24,21.11 32.24,25.84 31.66,26.41 v30.93,26.41 | J1.7 25.5,12.33 25.83,12.66 27.19,12.66 27.95,11.9 28.91,11.9 29.46,12.45 v29.46,13.18
  Bottom 0.125: v25.01,31.82 27.62,31.82 29.35,30.09 30.23,30.09 30.93,29.39 v30.93,26.42 v30.93,26.41 | v29.46,13.18 29.07,13.57 29.07,17.94 v29.54,18.41
B  (via drill 0.2 pad 0.4)
  Top 0.125: U$24.4 30.96,37.3 v30.3,37.3
  Bottom 0.2: v30.3,37.3 30.3,36.52 30.2,36.42 R0003.2
BATT_MONITOR  (via drill 0.2 pad 0.4)
  Top 0.125: U3.E4 25.39,33.03 v25,33.42
  Bottom 0.125: v25,33.42 24.54,33.42 23.1,31.98 21.18,31.98 21.17,31.99 20.79,31.61 20.79,30.93 21.41,30.31 22.23,30.31 22.95,29.59 22.95,28.22 22.7,27.97 22.7,18.18 23.18,17.7 23.18,14.36 22.64,13.82 21.92,13.82 | 21.92,13.82 R4_3.1 | R4_2.2 21.84,13.74 21.92,13.82
BLUE_LED  (via drill 0.2 pad 0.4)
  Top 0.125: U3.G2 27.41,35.03 28.42,35.03 v28.51,35.12
  Bottom 0.125: R0003.1 v28.51,35.12
CSRD
  Bottom 0.125: C3_1-0.1 32.91,17.59 32.91,19.38 33.01,19.48 U3-0.5
D6  (via drill 0.2 pad 0.4)
  Top 0.125: J1.8 25.5,17.86 v24.05,19.31 | U3.B6 v23.37,31.07
  Bottom 0.125: v24.05,19.31 23.9,19.46 23.9,28.91 23.37,29.44 v23.37,31.07
D12  (via drill 0.2 pad 0.4, 0.2 pad 0.45)
  Top 0.125: U3.C7 24.02,30.62 v24.57,30.07 | v27.48,14.69 27.02,14.69 26.45,15.26 26.45,19.06 26.18,19.33 v25.61,19.33 v25.6,19.32 | J1.9 26,12.2 26.12,12.32 26.78,12.32 v27.48,11.62
  Bottom 0.125: v25.6,19.32 24.57,20.35 v24.57,30.07 | v27.48,14.69 v27.48,11.62
D13  (via drill 0.2 pad 0.4)
  Top 0.125: U3.C6 v24.11,31.13 | J1.10 26,18.38 v25.77,18.61
  Bottom 0.125: v25.77,18.61 25.39,18.61 24.63,19.37 24.63,19.74 24.33,20.04 24.31,20.04 24.31,29.13 24.1,29.34 24.1,31.12 v24.11,31.13
EN  (via drill 0.2 pad 0.4)
  Top 0.152: R2_2.1 17.5,12.73 18.01,12.22 18.13,12.16 18.94,12.16 20.24,13.46 28.85,13.46 29.59,14.2 29.59,15.12 v29.95,15.48
  Top 0.254: U2.3 17.37,13.59 R2_2.1
  Bottom 0.125: v29.95,15.48 29.95,17.75 30.31,18.11 30.9,18.11 30.91,18.11 31.47,18.67 32.49,18.67 32.6,18.78 32.6,19.89 32.51,19.98 U3-0.9
G  (via drill 0.2 pad 0.4)
  Top 0.125: U$24.3 v30.98,35.89 v30.97,35.89
  Bottom 0.125: R0002.2 v30.97,35.89
GND  (via drill 0.2, 0.2 pad 0.4, 0.2 pad 0.45)
  Top 0.125: C8_2.2 27.49,21.11 27.41,21.19 U8.11 | U3.G0 27.01,36.71 v26.98,36.74 | U8.20 v27.42,26.34 v27.43,26.35 | D1.1 20.95,25.67 20.53,25.25 19.66,25.25 19.51,25.4 v18.12,25.4 | U8.25 v26.81,23.93 v26.8,23.94
  Top 0.2: U3.H7 U3.H6 | U3.H6 U3.H5 | U3.H5 U3.H4 U3.G4 U3.G5 | U3.G5 U3.H5 | U3.H6 U3.G6 U3.G5 | U8.25 v26.82,23.37 v26.81,23.36 | U2.2 16.03,15.85 C2_1.2 | USB1.5 12.1,24.04 USB1.P2 USB1.P1
  Bottom 0.2: J3.5 25.75,13.09 26.92,14.26 26.92,15.65 v27.45,16.18
  other vias: 16.38,34.02 16.3,36.38 28.26,26.83 29.23,31.16 21.42,15.15 22.37,15.15 18.4,28.68 26.17,23.95 30.82,21.93 37.18,17.76 26.18,23.36 27.48,23.37 27.47,23.96 26.15,24.5 26.78,24.5 27.4,24.51 21.06,14.57 15.25,15.83 23.19,11.47 33.16,25.12
  pour Top: 10.24,25.01 arc-90 25.04,39.81 arc-90 39.84,25.01 arc-90 25.04,10.21 arc-90
  pour Bottom: 10.21,25.04 arc-90 25.01,39.84 arc-90 39.81,25.04 arc-90 25.01,10.24 arc-90
  pour GND2-EC: 10.36,24.86 arc-90 25.16,39.66 arc-90 39.96,24.86 arc-90 25.16,10.06 arc-90
GREEN_LED  (via drill 0.2 pad 0.4)
  Top 0.125: v28.99,33.98 27.96,33.98 U3.H3
  Bottom 0.125: R0002.1 v28.99,33.98
INT_MPU  (via drill 0.2 pad 0.4)
  Top 0.125: U3.F3 26.23,33.82 v26.58,33.47 | v28.29,22.37 27.86,22.37 U8.12
  Bottom 0.125: v28.29,22.37 29.66,22.37 31.88,24.59 31.88,28.52 31.2,29.2 31.2,32.31 30.33,33.18 26.87,33.18 v26.58,33.47
INT_PPG  (via drill 0.2 pad 0.4)
  Top 0.125: v26.98,17.01 28.85,17.01 32.55,20.71 32.55,28.79 v31.92,29.42 | U3.G3 27.01,33.84 v27.4,34.23
  Bottom 0.125: v27.4,34.23 27.4,34.19 28.16,33.43 30.74,33.43 31.92,32.25 v31.92,29.42 | v26.98,17.01 26.84,17.01 25.74,18.11 24.23,18.11 23.5,17.38 23.5,14.23 24.25,13.48 J3.2
N$2
  Top 0.254: U4-0.1 R4_2-0.2
N$3
  Top 0.152: USB1.4 16.94,24.69 18.85,22.78 R2_1.2
N$4
  Top 0.125: U$3.P$2 26.87,28.95 26.62,29.2 26.62,31.03 26.21,31.43 U3.F6
  Top 0.2: C6_3.1 U$3.P$2
N$6
  Top 0.125: C6_4.1 27.03,27.88 26.64,28.27 26.64,28.63 26.32,28.95 26.13,28.95 | 26.13,28.95 U$3.P$1 | U3.F7 26.2,29.02 26.13,28.95
N$7
  Bottom 0.152: U3-0.10 30.24,20.48 R3_10.1
N$8
  Top 0.254: R4_2-0.1 LED4_1-0.C
N$10
  Top 0.254: R4-1-0.1 19.11,22.09 19.98,21.22 U4-0.5
N$17
  Top 0.125: U3.A6 21.6,31.44 21.3,31.14 21.3,30.68 21.67,30.31 L3.2
N$28
  Top 0.125: U8.10 27.02,21.21 C8_2.1
QSPI_CS
  Top 0.125: U3.C2 23.63,34.64 23.29,34.98 21.53,34.98 21,35.51 U4.1
QSPI_DATA0  (via drill 0.2 pad 0.45)
  Top 0.125: U4.5 16.26,30.57 v16.27,30.59 | v20.79,33.82 20.92,33.69 21.5,33.69 21.62,33.81 22.2,33.81 U3.A3
  Bottom 0.125: v16.27,30.59 19.5,33.82 v20.79,33.82
QSPI_DATA1  (via drill 0.2 pad 0.4)
  Top 0.125: U4.2 18.82,35.48 v18.82,34.83 | v23.37,34.24 23,34.61 U3.B2
  Bottom 0.125: v23.37,34.24 22.56,35.05 19.04,35.05 v18.82,34.83
QSPI_DATA2
  Top 0.125: U3.F0 25.62,36.81 17.94,36.81 17.52,36.39 U4.3
QSPI_DATA3  (via drill 0.2 pad 0.4, 0.2 pad 0.45)
  Top 0.125: U4.7 v18.8,30.58 v18.8,30.59 | U3.C3 23.47,33.48 21.89,33.48 v21.2,32.79
  Bottom 0.125: v21.2,32.79 21.18,32.81 20.35,32.81 18.8,31.26 v18.8,30.59
QSPI_SCK  (via drill 0.2 pad 0.4, 0.2 pad 0.45)
  Top 0.125: U3.A2 21.84,34.27 v21.32,34.27 | U4.6 17.52,30.57 v17.55,30.6
  Bottom 0.125: v17.55,30.6 20.09,33.14 20.85,33.14 21.32,33.61 v21.32,34.27
R
  Top 0.125: R0001.2 31.85,36.44 U$24.2
RED_LED
  Top 0.125: R0001.1 30.09,33.98 29.42,34.65 U3.H2
RESET  (via drill 0.2 pad 0.4)
  Top 0.125: U3.B4 v22.65,32.69
  Bottom 0.125: v22.65,32.69 22.65,34.11 22.03,34.73 19.64,34.73 16.63,31.72 16.13,31.72 15.11,30.7 RESET.P$1
SCL  (via drill 0.15, 0.2, 0.2 pad 0.4)
  Top 0.125: U3.D5 v24.23,31.86 | J1.6 v25,16.75 25,17.42 23.42,19 v23.42,23.97 | U8.23 26.22,26.5 | v23.4,26.11 23.79,26.5 26.22,26.5 | 26.22,26.5 26.22,27.17 R0005.1 26.43,27.28 v27.12,27.28
  Bottom 0.125: J3.3 24.75,16.5 v25,16.75 | v24.23,31.86 25.11,30.98 25.11,28.86 26.69,27.28 v27.12,27.28 | v23.42,23.97 23.42,26.09 v23.4,26.11
SDA  (via drill 0.2 pad 0.4)
  Top 0.125: U3.B7 23,27.35 R0004.1 22.93,27.28 22.93,25.31 | J1.4 24.5,17.15 v24.36,17.29 22.93,18.72 22.93,25.31 | U8.24 25.82,26.07 25.67,26.22 25.13,26.22 24.22,25.31 22.93,25.31
  Bottom 0.125: J3.4 25.25,15.16 25.94,15.85 25.94,17 25.65,17.29 v24.36,17.29
SWDCLK  (via drill 0.2 pad 0.45)
  Top 0.125: U3.C1 v23.4,35.83 v23.4,35.84
  Bottom 0.125: v23.4,35.84 22.6,36.64 18.62,36.64 18.62,36.63 17.92,36.63 15.9,34.61 SWCLK.P$1
SWDIO  (via drill 0.2 pad 0.45)
  Top 0.125: U3.B1 22.61,35.81 v22.61,35.83
  Bottom 0.125: SWIO.P$1 13.92,32.83 16.81,32.83 18.18,34.2 18.18,35.42 18.59,35.83 v22.61,35.83
SWO  (via drill 0.2 pad 0.45)
  Top 0.125: U3.D0 24.6,36.23 v24.2,35.83
  Bottom 0.125: v24.2,35.83 23.13,36.9 18.75,36.9 SWO.P$1
USB_D+  (via drill 0.2, 0.3 pad 0.6)
  Top 0.125: U3.A4 20.59,31.41 20.59,27.78 20.2,27.39 19.8,27.39 v19.22,26.81
  Top 0.152: v19.24,24.76 D1.3
  Top 0.2: USB1.3 16.96,25.34 18.3,24 D1.3
  Bottom 0.125: v19.24,24.76 19.24,26.79 v19.22,26.81
USB_D-
  Top 0.125: U3.A5 21.8,31.81 21.52,31.81 20.84,31.13 20.84,27.56 20.13,26.85 20.13,26.28 19.85,26 D1.2
  Top 0.2: D1.2 19.2,25.95 19.16,25.99 USB1.2
VBATT  (via drill 0.2 pad 0.4, 0.2 pad 0.45)
  Top 0.152: 18.5,13.82 28.47,13.82 29.21,14.56 29.21,16.72 31.04,18.55 33.21,18.55 33.98,19.32 v33.98,22.2
  Top 0.203: C2_1.1 13.88,16.83 v13.86,16.81
  Top 0.254: U2.1 17.34,16.83 C2_1.1 15.99,16.85 C4_1.2 17.21,18.52 17.37,18.36 | U2.1 17.37,18.36 | 17.37,18.36 U4-0.3 | R2_2.2 18.5,13.82 18.5,16.51 18.21,16.8 U2.1
  Bottom 0.152: TP4.P$1 16.93,13.21 17.73,12.4 18.11,12.23 18.12,12.22 18.26,12.16 19.77,11.46 19.78,11.47 v20.6,11.47 20.6,12.7 R4_2.1 | v33.98,22.2 33.98,21.5 U3-0.1
  Bottom 0.2: TP4.P$1 16.93,14.41 PWR1.+
  Bottom 0.254: TP4.P$1 15.5,14.33 13.86,15.97 v13.86,16.81
VBUS  (via drill 0.2 pad 0.4, 0.3)
  Top 0.125: U3.B5 22.61,31.84 22.61,29.11 v22.48,28.98
  Top 0.152: 21.3,23.85 D1.4
  Top 0.2: U4-0.4 21.04,18.61 21.35,18.92 C2_4.1 C6_2.1 21.34,22.68 21.37,22.71 | R2_1.1 21.3,23.85
  Top 0.254: 21.37,22.71 R2_1.1 | LED4_1-0.A 13.67,17.94 14.36,17.94 v14.38,17.96
  Top 0.305: v16.8,26.6 16.76,26.64 USB1.1 | v22.1,24.2 21.9,24 D1.4
  Bottom 0.2: 20.98,26.77 20.93,26.82 20.93,28.48 21.43,28.98 v22.48,28.98
  Bottom 0.254: v16.8,26.6 16.78,26.62 14.69,26.62 13.67,25.6 13.67,18.67 v14.38,17.96
  Bottom 0.305: v22.1,24.2 22.1,26.61 21.94,26.77 20.98,26.77 20.37,26.77 19.48,27.66 17.86,27.66 v16.8,26.6
VREF
  Bottom 0.125: U3-0.3 33.12,20.48 32.88,20.72 C3_2-0.1

### Text on the board
tNames: SCAP V0.31
bNames: GND | Rx | Tx | SCAP V0.31 | GND | 3V | 3V | GND